# Altium schematic sheet FPGA_PWR_CONFIG.SchDoc: SPEC-A7
size 420 x 297 mm; Author: G.Kasprowicz; CompanyName: WUT ISE; DrawnBy: G.Kasprowicz; Organization: WUT ISE; Address1: PW ISE; Address2: Nowowiejska 15/19 00-665 Warsaw; Address3: gkasprow@gmail.com; Revision: 2; SheetNumber: 6; SheetTotal: 18; ModifiedBy: -; CheckedDate: -; Title2: FPGA Power & Config; DivGrp: WUT ISE; Designer: G.Kasprowicz; ModifiedDate: -; ProjectName: Sensor Box
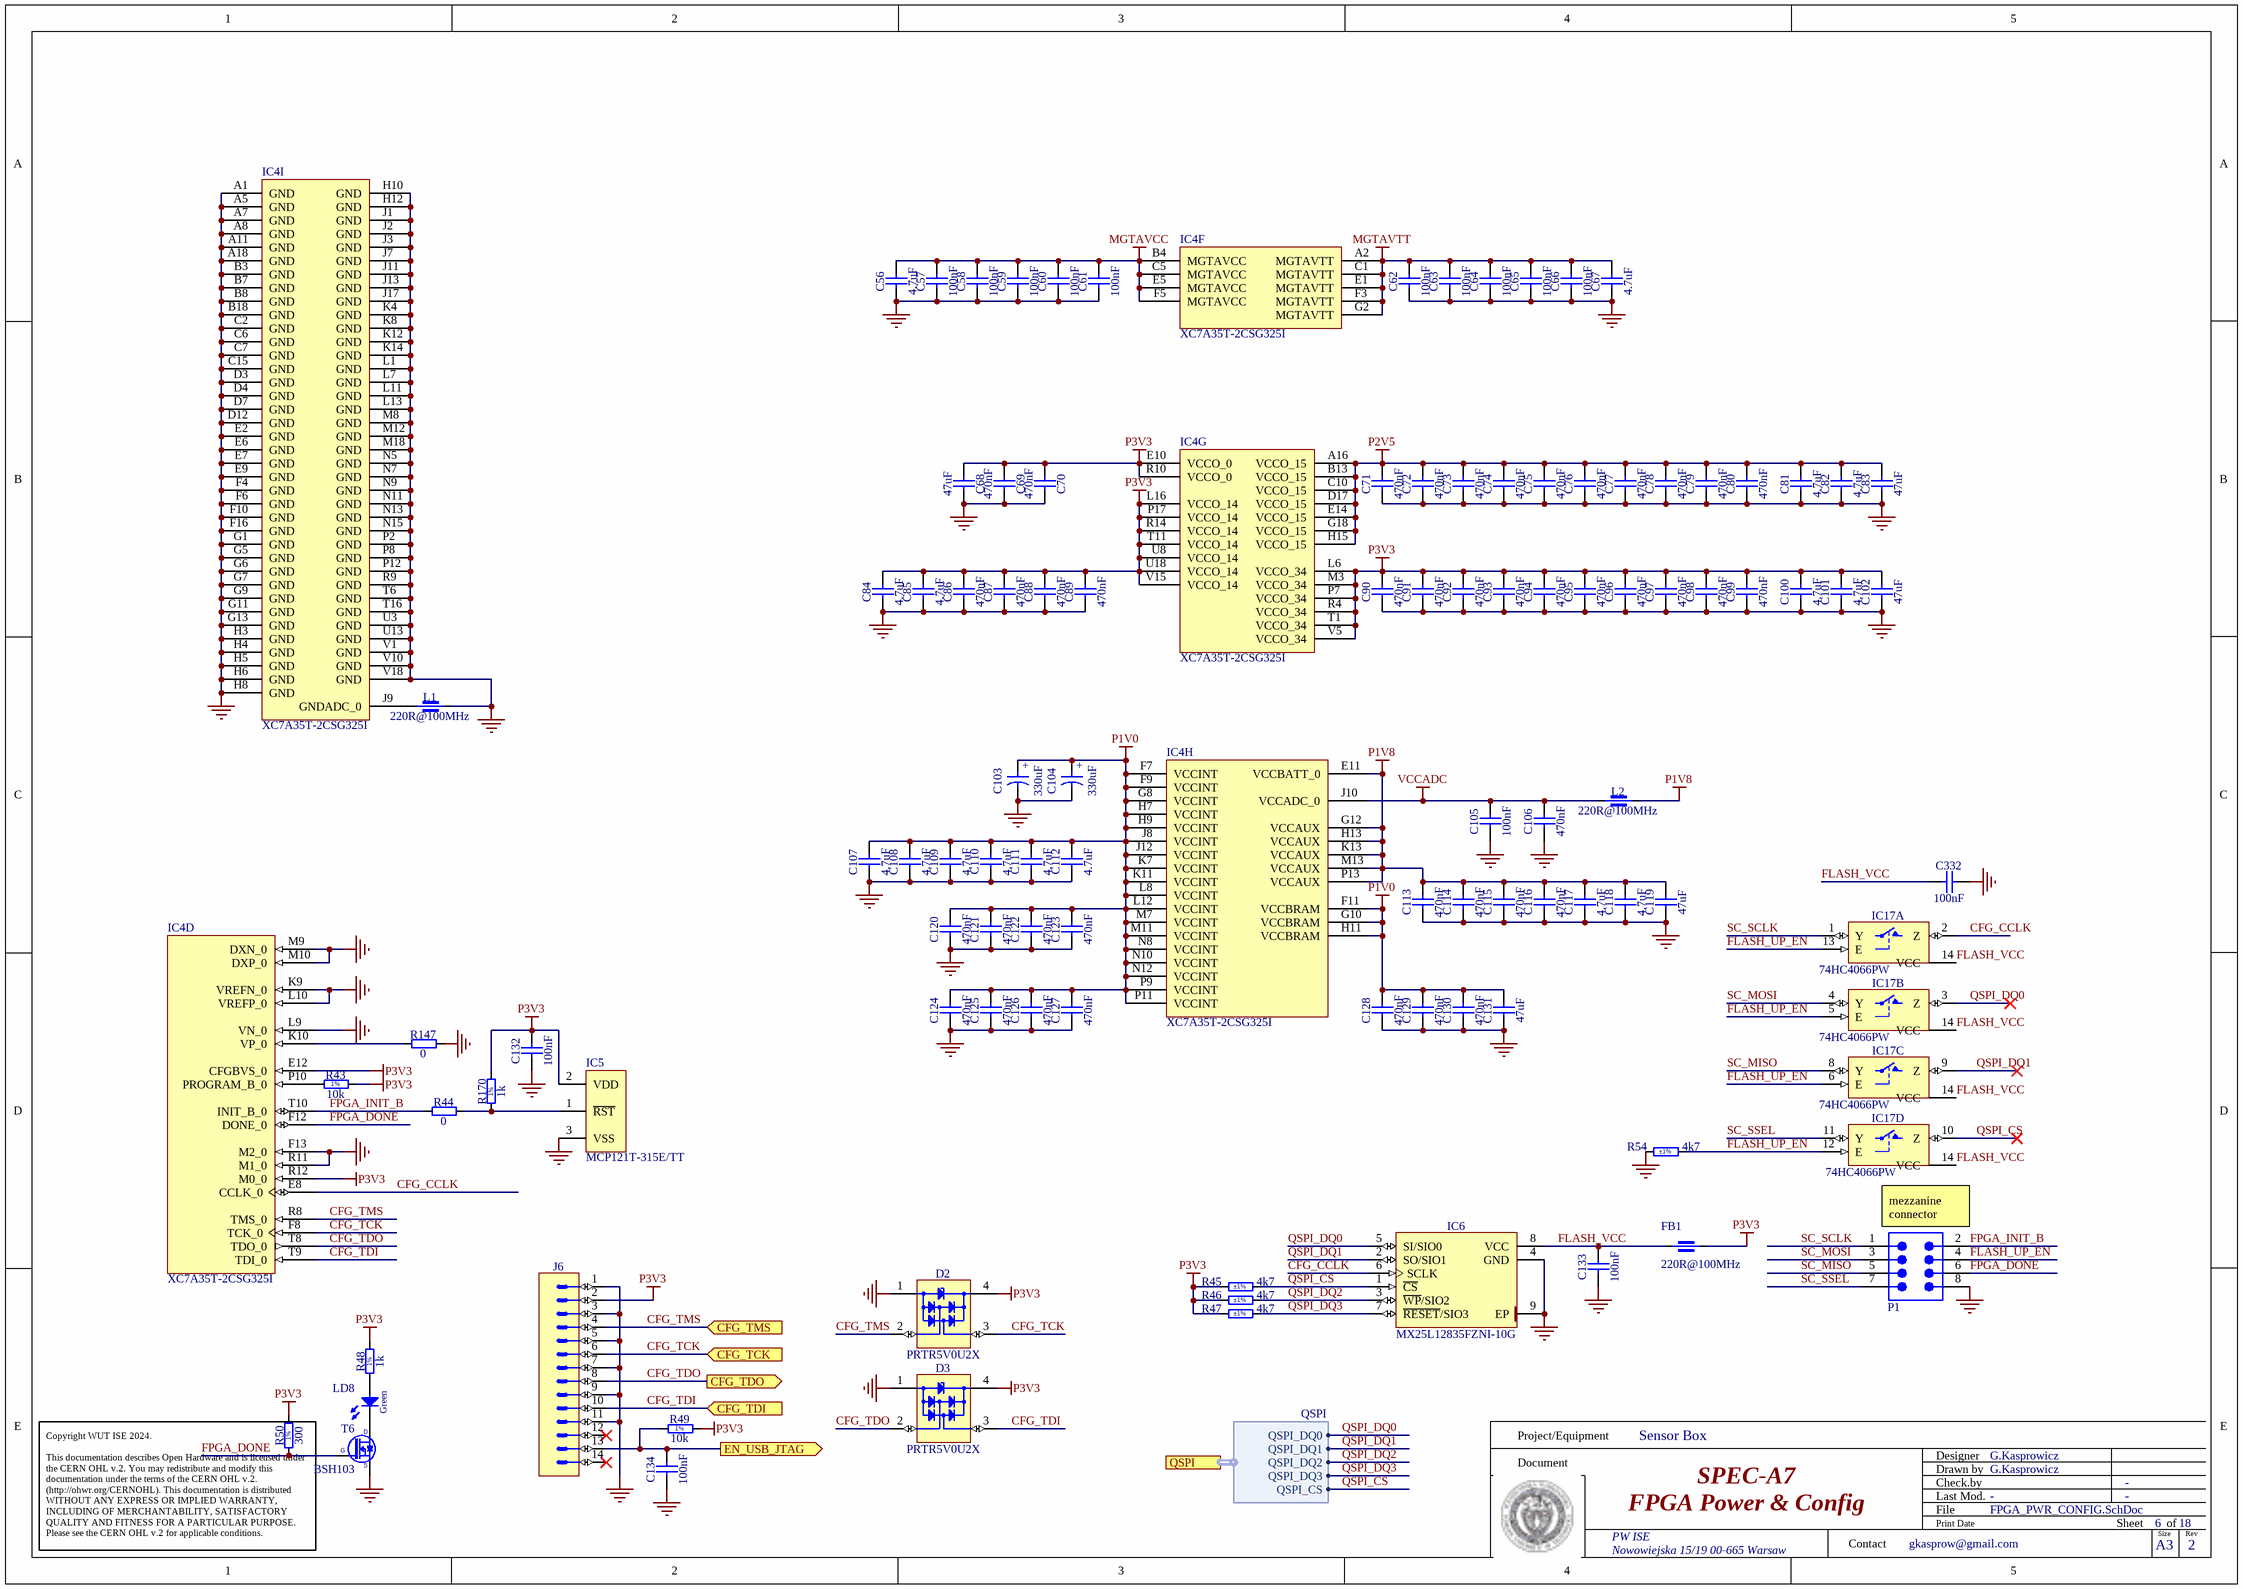
[diagram p0: FPGA_PWR_CONFIG.SchDoc]

## Parts
C56  4.7uF  [CAPC1005X55N]
C57  100nF  [CAPC0603X33N]
C58  100nF  [CAPC0603X33N]
C59  100nF  [CAPC0603X33N]
C60  100nF  [CAPC0603X33N]
C61  100nF  [CAPC0603X33N]
C62  100nF  [CAPC0603X33N]
C63  100nF  [CAPC0603X33N]
C64  100nF  [CAPC0603X33N]
C65  100nF  [CAPC0603X33N]
C66  100nF  [CAPC0603X33N]
C67  4.7uF  [CAPC1005X55N]
C68  47uF  [CAPC1608X100N]
C69  470nF  [CAPC0603X33N]
C70  470nF  [CAPC0603X33N]
C71  470nF  [CAPC0603X33N]
C72  470nF  [CAPC0603X33N]
C73  470nF  [CAPC0603X33N]
C74  470nF  [CAPC0603X33N]
C75  470nF  [CAPC0603X33N]
C76  470nF  [CAPC0603X33N]
C77  470nF  [CAPC0603X33N]
C78  470nF  [CAPC0603X33N]
C79  470nF  [CAPC0603X33N]
C80  470nF  [CAPC0603X33N]
C81  4.7uF  [CAPC1005X55N]
C82  4.7uF  [CAPC1005X55N]
C83  47uF  [CAPC1608X100N]
C84  4.7uF  [CAPC1005X55N]
C85  4.7uF  [CAPC1005X55N]
C86  470nF  [CAPC0603X33N]
C87  470nF  [CAPC0603X33N]
C88  470nF  [CAPC0603X33N]
C89  470nF  [CAPC0603X33N]
C90  470nF  [CAPC0603X33N]
C91  470nF  [CAPC0603X33N]
C92  470nF  [CAPC0603X33N]
C93  470nF  [CAPC0603X33N]
C94  470nF  [CAPC0603X33N]
C95  470nF  [CAPC0603X33N]
C96  470nF  [CAPC0603X33N]
C97  470nF  [CAPC0603X33N]
C98  470nF  [CAPC0603X33N]
C99  470nF  [CAPC0603X33N]
C100  4.7uF  [CAPC1005X55N]
C101  4.7uF  [CAPC1005X55N]
C102  47uF  [CAPC1608X100N]
C103  330uF  [CAPMP7343X190N]
C104  330uF  [CAPMP7343X190N]
C105  100nF  [CAPC0603X33N]
C106  470nF  [CAPC0603X33N]
C107  4.7uF  [CAPC1005X55N]
C108  4.7uF  [CAPC1005X55N]
C109  4.7uF  [CAPC1005X55N]
C110  4.7uF  [CAPC1005X55N]
C111  4.7uF  [CAPC1005X55N]
C112  4.7uF  [CAPC1005X55N]
C113  470nF  [CAPC0603X33N]
C114  470nF  [CAPC0603X33N]
C115  470nF  [CAPC0603X33N]
C116  470nF  [CAPC0603X33N]
C117  4.7uF  [CAPC1005X55N]
C118  4.7uF  [CAPC1005X55N]
C119  47uF  [CAPC1608X100N]
C120  470nF  [CAPC0603X33N]
C121  470nF  [CAPC0603X33N]
C122  470nF  [CAPC0603X33N]
C123  470nF  [CAPC0603X33N]
C124  470nF  [CAPC0603X33N]
C125  470nF  [CAPC0603X33N]
C126  470nF  [CAPC0603X33N]
C127  470nF  [CAPC0603X33N]
C128  470nF  [CAPC0603X33N]
C129  470nF  [CAPC0603X33N]
C130  470nF  [CAPC0603X33N]
C131  47uF  [CAPC1608X100N]
C132  100nF  [CAPC0603X33N]
C133  100nF  [CAPC0603X33N]
C134  100nF  [CAPC0603X33N]
C332  100nF  [CAPC0603X33N]
D2  PRTR5V0U2X  [SOT190P230X110-4N]
D3  PRTR5V0U2X  [SOT190P230X110-4N]
FB1  220R@100MHz  [INDC1608X95N]
IC4  XC7A35T-2CSG325I  [CSG325]  (parts D,F,G,H,I of 9)
IC5  MCP121T-315E/TT  [SOT-23-TT3_L]
IC6  MX25L12835FZNI-10G  [SON127P600X500X80-9N-R350X410]
IC17  74HC4066PW  [SOP65P640X110-14N]  (parts A,B,C,D of 4)
J6  Milli-Grid™  [MOLEX_87832-1420]  (value not drawn)
L1  220R@100MHz  [INDC1005X55N]
L2  220R@100MHz  [INDC1005X55N]
LD8  Green  [LED_KINGBRIGHT_KPH-1608CGCK]
P1  61300821121  [61300821121]  (value not drawn)
R43  10k  [RESC1005X40N]
R44  0  [RESC1005X40N]
R45  4k7  Tolerance: ±1%  [RESC1005X40N]
R46  4k7  Tolerance: ±1%  [RESC1005X40N]
R47  4k7  Tolerance: ±1%  [RESC1005X40N]
R48  1k  [RESC1005X40N]
R49  10k  [RESC1005X40N]
R50  300  [RESC1005X40N]
R54  4k7  Tolerance: ±1%  [RESC1005X40N]
R147  0  [RESC1005X40N]
R170  1k  [RESC1005X40N]
T6  BSH103  [SOT95P230X110-3N]

## Ports
CFG_TCK (in, see SPEC-A7-TOP[3D]), CFG_TDI (in, see SPEC-A7-TOP[3D]), CFG_TDO (out, see SPEC-A7-TOP[3D]), CFG_TMS (in, see SPEC-A7-TOP[3D]), EN_USB_JTAG (out, see SPEC-A7-TOP[3D], USB_Serial_Quad[5C]), QSPI (harness QSPI, see SPEC-A7-TOP[3D], FPGA_14_15[3D])

## Harnesses
QSPI: QSPI_DQ0, QSPI_DQ1, QSPI_DQ2, QSPI_DQ3, QSPI_CS

## Nets
GND: C56.1 C57.1 C58.1 C59.1 C60.1 C61.1 C62.1 C63.1 C64.1 C65.1 C66.1 C67.1 C68.1 C69.1 C70.1 C71.1 C72.1 C73.1 C74.1 C75.1 C76.1 C77.1 C78.1 C79.1 C80.1 C81.1 C82.1 C83.1 C84.1 C85.1 C86.1 C87.1 C88.1 C89.1 C90.1 C91.1 C92.1 C93.1 C94.1 C95.1 C96.1 C97.1 C98.1 C99.1 C100.1 C101.1 C102.1 C103.2 C104.2 C105.1 C106.1 C107.1 C108.1 C109.1 C110.1 C111.1 C112.1 C113.1 C114.1 C115.1 C116.1 C117.1 C118.1 C119.1 C120.1 C121.1 C122.1 C123.1 C124.1 C125.1 C126.1 C127.1 C128.1 C129.1 C130.1 C131.1 C132.1 C133.1 C134.1 C332.2 D2.1(GND) D3.1(GND) IC4.A1(GND) IC4.A5(GND) IC4.A7(GND) IC4.A8(GND) IC4.A11(GND) IC4.A18(GND) IC4.B3(GND) IC4.B7(GND) IC4.B8(GND) IC4.B18(GND) IC4.C2(GND) IC4.C6(GND) IC4.C7(GND) IC4.C15(GND) IC4.D3(GND) IC4.D4(GND) IC4.D7(GND) IC4.D12(GND) IC4.E2(GND) IC4.E6(GND) IC4.E7(GND) IC4.E9(GND) IC4.F4(GND) IC4.F6(GND) IC4.F10(GND) IC4.F13(M2_0) IC4.F16(GND) IC4.G1(GND) IC4.G5(GND) IC4.G6(GND) IC4.G7(GND) IC4.G9(GND) IC4.G11(GND) IC4.G13(GND) IC4.H3(GND) IC4.H4(GND) IC4.H5(GND) IC4.H6(GND) IC4.H8(GND) IC4.H10(GND) IC4.H12(GND) IC4.J1(GND) IC4.J2(GND) IC4.J3(GND) IC4.J7(GND) IC4.J11(GND) IC4.J13(GND) IC4.J17(GND) IC4.K4(GND) IC4.K8(GND) IC4.K9(VREFN_0) IC4.K12(GND) IC4.K14(GND) IC4.L1(GND) IC4.L7(GND) IC4.L9(VN_0) IC4.L10(VREFP_0) IC4.L11(GND) IC4.L13(GND) IC4.M8(GND) IC4.M9(DXN_0) IC4.M10(DXP_0) IC4.M12(GND) IC4.M18(GND) IC4.N5(GND) IC4.N7(GND) IC4.N9(GND) IC4.N11(GND) IC4.N13(GND) IC4.N15(GND) IC4.P2(GND) IC4.P8(GND) IC4.P12(GND) IC4.R9(GND) IC4.R11(M1_0) IC4.T6(GND) IC4.T16(GND) IC4.U3(GND) IC4.U13(GND) IC4.V1(GND) IC4.V10(GND) IC4.V18(GND) IC5.3(VSS) IC6.4(GND) IC6.9(EP) IC17.7(GND) J6.1 J6.3 J6.5 J6.7 J6.9 J6.11 L1.2 P1.8 R54.1 R147.2 T6.2(S)
MGTAVCC: C56.2 C57.2 C58.2 C59.2 C60.2 C61.2 IC4.B4(MGTAVCC) IC4.C5(MGTAVCC) IC4.E5(MGTAVCC) IC4.F5(MGTAVCC)
MGTAVTT: C62.2 C63.2 C64.2 C65.2 C66.2 C67.2 IC4.A2(MGTAVTT) IC4.C1(MGTAVTT) IC4.E1(MGTAVTT) IC4.F3(MGTAVTT) IC4.G2(MGTAVTT)
P1V0: C103.1 C104.1 C107.2 C108.2 C109.2 C110.2 C111.2 C112.2 C120.2 C121.2 C122.2 C123.2 C124.2 C125.2 C126.2 C127.2 C128.2 C129.2 C130.2 C131.2 IC4.F7(VCCINT) IC4.F9(VCCINT) IC4.F11(VCCBRAM) IC4.G8(VCCINT) IC4.G10(VCCBRAM) IC4.H7(VCCINT) IC4.H9(VCCINT) IC4.H11(VCCBRAM) IC4.J8(VCCINT) IC4.J12(VCCINT) IC4.K7(VCCINT) IC4.K11(VCCINT) IC4.L8(VCCINT) IC4.L12(VCCINT) IC4.M7(VCCINT) IC4.M11(VCCINT) IC4.N8(VCCINT) IC4.N10(VCCINT) IC4.N12(VCCINT) IC4.P9(VCCINT) IC4.P11(VCCINT)
P1V8: C113.2 C114.2 C115.2 C116.2 C117.2 C118.2 C119.2 IC4.E11(VCCBATT_0) IC4.G12(VCCAUX) IC4.H13(VCCAUX) IC4.K13(VCCAUX) IC4.M13(VCCAUX) IC4.P13(VCCAUX) L2.2
P2V5: C71.2 C72.2 C73.2 C74.2 C75.2 C76.2 C77.2 C78.2 C79.2 C80.2 C81.2 C82.2 C83.2 IC4.A16(VCCO_15) IC4.B13(VCCO_15) IC4.C10(VCCO_15) IC4.D17(VCCO_15) IC4.E14(VCCO_15) IC4.G18(VCCO_15) IC4.H15(VCCO_15)
P3V3: C68.2 C69.2 C70.2 C84.2 C85.2 C86.2 C87.2 C88.2 C89.2 C90.2 C91.2 C92.2 C93.2 C94.2 C95.2 C96.2 C97.2 C98.2 C99.2 C100.2 C101.2 C102.2 C132.2 D2.4(VCC) D3.4(VCC) FB1.1 IC4.E10(VCCO_0) IC4.E12(CFGBVS_0) IC4.L6(VCCO_34) IC4.L16(VCCO_14) IC4.M3(VCCO_34) IC4.P7(VCCO_34) IC4.P17(VCCO_14) IC4.R4(VCCO_34) IC4.R10(VCCO_0) IC4.R12(M0_0) IC4.R14(VCCO_14) IC4.T1(VCCO_34) IC4.T11(VCCO_14) IC4.U8(VCCO_14) IC4.U18(VCCO_14) IC4.V5(VCCO_34) IC4.V15(VCCO_14) IC5.2(VDD) J6.2 R43.2 R45.1 R46.1 R47.1 R48.2 R49.2 R50.2 R170.2
VCCADC: C105.2 C106.2 IC4.J10(VCCADC_0) L2.1
CFG_CCLK: IC4.E8(CCLK_0) IC6.6(SCLK) IC17.2(Z)
CFG_TCK: D2.3(I/O2) IC4.F8(TCK_0) J6.6 ; port CFG_TCK
CFG_TDI: D3.3(I/O2) IC4.T9(TDI_0) J6.10 ; port CFG_TDI
CFG_TDO: D3.2(I/O1) IC4.T8(TDO_0) J6.8 ; port CFG_TDO
CFG_TMS: D2.2(I/O1) IC4.R8(TMS_0) J6.4 ; port CFG_TMS
EN_USB_JTAG: C134.2 J6.13 R49.1 ; port EN_USB_JTAG
FLASH_UP_EN: IC17.5(E) IC17.6(E) IC17.12(E) IC17.13(E) P1.4 R54.2
FLASH_VCC: C133.2 C332.1 FB1.2 IC6.8(VCC) IC17.14(VCC)
FPGA_DONE: IC4.F12(DONE_0) P1.6 R50.1 T6.1(G)
FPGA_INIT_B: IC4.T10(INIT_B_0) P1.2 R44.1
QSPI_CS: IC6.1(~{CS}) IC17.10(Z) R45.2 ; port QSPI.QSPI_CS
QSPI_DQ0: IC6.5(SI/SIO0) IC17.3(Z) ; port QSPI.QSPI_DQ0
QSPI_DQ1: IC6.2(SO/SIO1) IC17.9(Z) ; port QSPI.QSPI_DQ1
QSPI_DQ2: IC6.3(~{WP}/SIO2) R46.2 ; port QSPI.QSPI_DQ2
QSPI_DQ3: IC6.7(~{RESET}/SIO3) R47.2 ; port QSPI.QSPI_DQ3
SC_MISO: IC17.8(Y) P1.5
SC_MOSI: IC17.4(Y) P1.3
SC_SCLK: IC17.1(Y) P1.1
SC_SSEL: IC17.11(Y) P1.7
NetIC4_J9: IC4.J9(GNDADC_0) L1.1
NetIC4_K10: IC4.K10(VP_0) R147.1
NetIC4_P10: IC4.P10(PROGRAM_B_0) R43.1
NetIC5_1: IC5.1(~{RST}) R44.2 R170.1
NetLD8_1: LD8.1(C) T6.3(D)
NetLD8_2: LD8.2(A) R48.1

Not connected (* = marked no-connect by the designer): J6 12* 14*

## Notes on the sheet
- mezzanine connector
- Project/Equipment
- Document
- Designer
- Drawn by
- Check.by
- Copyright WUT ISE 2024.
  This documentation describes Open Hardware and is licensed under the CERN OHL v.2. You may redistribute and modify this documentation under the terms of the CERN OHL v.2. (http://ohwr.org/CERNOHL). This documentation is distributed WITHOUT ANY EXPRESS OR IMPLIED WARRANTY, INCLUDING OF MERCHANTABILITY, SATISFACTORY QUALITY AND FITNESS FOR A PARTICULAR PURPOSE. Please see the CERN OHL v.2 for applicable conditions.
- Contact
- File
- Last Mod.
- Print Date
- Sheet
- Size
- A3
- of
- Rev
- (in symbol CTE7343-19_330UF_2.5V_20%_LESR0025_KEMET_T520) +
- (in symbol R0402_1k_1%_0.0625W_100PPM) 1%
- (in symbol R0402_10K_1%_0.0625W_100PPM) 1%
- (in symbol R0402_300R_1%_0.0625W_100PPM) 1%

## Library data of the parts
C56 C67 C81 C82 C84 C85 C100 C101 C107-C112 C117 C118 = CC0402_4.7UF_6.3V_20%_X5R: Non-polarised capacitor; Part Description: SMD Multilayer Chip Ceramic Capacitor; Manufacturer: GENERIC; Manufacturer1 Part Number: C1005X5R0J475M050BC; Voltage: 6.3V; TC: X5R; Tolerance: ±20%; Part Number: CC0402_4.7UF_6.3V_20%_X5R; Component Kind: Standard; Component Type: Standard; Pin Count: 2; Value: 4.7uF; Status: Preferred; Manufacturer Part Number: CC0402_4.7UF_6.3V_20%_X5R; Case: 0402; Mounted: Yes; Socket: No; SMD: Yes; Sense: No; Manufacturer1 Example: TDK; Manufacturer1 ComponentHeight: 0.65mm; HelpURL: \\cern.ch\dfs\Applications\Altium\Datasheets\CC0402_X5R_TDK_C.pdf; Author: CERN DEM JLC; CreateDate: 03.03.2015; LatestRevisionDate: 03.03.2015
C57-C66 C105 C132-C134 C332 = CC0201_100NF_6.3V_10%_X5R: Non-polarised capacitor; Part Description: SMD Multilayer Chip Ceramic Capacitor; Manufacturer: GENERIC; Manufacturer1 Part Number: 02016D104KAT2A; Voltage: 6.3V; TC: X5R; Tolerance: ±10%; Part Number: CC0201_100NF_6.3V_10%_X5R; Component Kind: Standard; Component Type: Standard; Pin Count: 2; Value: 100nF; Status: Not Recommended; Manufacturer Part Number: CC0201_100NF_6.3V_10%_X5R; Case: 0201; Mounted: Yes; Socket: No; SMD: Yes; Sense: No; Manufacturer1 Example: AVX; Manufacturer1 ComponentHeight: 0.33mm; HelpURL: \\cern.ch\dfs\Applications\Altium\Datasheets\CC0201_X5R_AVX.pdf; Author: CERN DEM JLC
  C57-C66 C105 C332: CreateDate: 03.12.2007; LatestRevisionDate: 03.12.2007
  C132-C134: CreateDate: 2007-12-03; LatestRevisionDate: 2007-12-03; ClassName: FPGA_JTAG
C68 C83 C102 C119 C131 = CC0603_47UF_6.3V_20%_X5R: Non-polarised capacitor; Part Description: SMD Multilayer Chip Ceramic Capacitor; Manufacturer: GENERIC; Manufacturer1 Part Number: GRM188R60J476ME15D; Voltage: 6.3V; TC: X5R; Tolerance: ±20%; Part Number: CC0603_47UF_6.3V_20%_X5R; Component Kind: Standard; Component Type: Standard; Pin Count: 2; Value: 47uF; Status: None; Manufacturer Part Number: CC0603_47UF_6.3V_20%_X5R; Case: 0603; Mounted: Yes; Socket: No; SMD: Yes; Sense: No; Manufacturer1 Example: MURATA; Manufacturer1 ComponentHeight: 1mm; HelpURL: \\cern.ch\dfs\Applications\Altium\Datasheets\CC0603_MURATA_GRM188R60J476ME15D.pdf; Author: CERN DEM JLC; CreateDate: 01.02.2018; LatestRevisionDate: 01.02.2018
C69-C80 C86-C99 C106 C113-C116 C120-C130 = CC0201_470NF_4V_20%_X5R: Non-polarised capacitor; Part Description: SMD Multilayer Chip Ceramic Capacitor; Manufacturer: GENERIC; Manufacturer1 Part Number: AMK063BJ474MP-F; Voltage: 4V; TC: X5R; Tolerance: ±20%; Part Number: CC0201_470NF_4V_20%_X5R; Component Kind: Standard; Component Type: Standard; Pin Count: 2; Value: 470nF; Status: Not Recommended; Manufacturer Part Number: CC0201_470NF_4V_20%_X5R; Case: 0201; Mounted: Yes; Socket: No; SMD: Yes; Sense: No; Manufacturer1 Example: TAIYO YUDEN; Manufacturer1 ComponentHeight: 0.33mm; HelpURL: \\cern.ch\dfs\Applications\Altium\Datasheets\CC0201_X5R_TAIYO-YUDEN_STANDARD-CLASS2.pdf; Author: CERN DEM JLC; CreateDate: 27.05.2010; LatestRevisionDate: 27.05.2010
C103 C104 = CTE7343-19_330UF_2.5V_20%_LESR0025_KEMET_T520: Polarised capacitor; Part Description: Low ESR 0R025 Tantalum Chip Capacitor; Manufacturer: KEMET; Manufacturer Part Number: T520V337M2R5ATE025; Voltage: 2.5V; Tolerance: ±20%; Part Number: CTE7343-19_330UF_2.5V_20%_LESR0025_KEMET_T520; Component Kind: Standard; Component Type: Standard; Pin Count: 2; Value: 330uF; Status: None; Case: V; Mounted: Yes; Socket: No; SMD: Yes; Sense: No; ComponentHeight: 1.9mm; HelpURL: \\cern.ch\dfs\Applications\Altium\Datasheets\CTE-LESR_KEMET_T520.pdf; Author: CERN DEM MR; CreateDate: 23.03.2016; LatestRevisionDate: 23.03.2016
D2 D3 = PRTR5V0U2X: Ultra Low Capacitance Double Rail-to-Rail ESD Protection Diode; Part Description: Ultra Low Capacitance (1pF) Double Rail-to-Rail ESD Protection Diode (8kV); Manufacturer: NXP SEMICONDUCTORS; Voltage: 5.5V; PressFit: No; Bonding: No; Part Number: PRTR5V0U2X; Component Kind: Standard; Component Type: Standard; Device: PRTR5V0U2X; PackageDescription: SOT143B, SOT, 1.90mm Pitch; 4 Pin, 1.30mm W X 2.90mm L X 1.10mm H body, IPC Medium Density; Manufacturer Part Number: PRTR5V0U2X; Pin Count: 4; Case: SOT143B; Mounted: Yes; Socket: No; SMD: Yes; Sense: No; ComponentHeight: 1.1mm; HelpURL: \\cern.ch\dfs\Applications\Altium\Datasheets\PRTR5V0U2X.pdf; Author: CERN DEM JLC; CreateDate: 22.03.2011; LatestRevisionDate: 22.03.2011
FB1 = IND0603_MURATA_BLM18SG221TN1: Part Description: SMD EMIFIL Suppression Chip Ferrite Bead; Manufacturer: MURATA; Tolerance: ±25%; Power: 2.5A; Resistance: 0.04R; Part Number: IND0603_MURATA_BLM18SG221TN1; Component Kind: Standard; Component Type: Standard; Pin Count: 2; Value: 220R@100MHz; Manufacturer Part Number: BLM18SG221TN1; Case: 0603; Mounted: Yes; Socket: No; SMD: Yes; Sense: No; ComponentHeight: 0.95mm; HelpURL: \\cern.ch\dfs\Applications\Altium\Datasheets\IND0603_MURATA_BLM18S.pdf; Author: CERN DEM MR; CreateDate: 08.01.2016; LatestRevisionDate: 25.10.2018
IC4 = CMP-0383-00003-1: Artix-7 FPGA, 150 User I/Os, 4 GTP, 324-Ball BGA, Speed Grade 2, Industrial Grade, Pb-Free; Manufacturer: Xilinx; Available User I/O: 150; Speed Grades: 2; GTP: 4; Logic Cells: 33280; Total Block RAM: 1800 Kb; CMTs: 5; ComponentLink3URL: http://www.xilinx.com/support/documentation/user_guides/ug475_7Series_Pkg_Pinout.pdf; Maximum Distributed RAM: 400 Kb; Operating Temperature Range: Industrial; ComponentLink1URL: http://www.xilinx.com/; Mounting Technology: Surface Mount; ComponentLink1Description: Manufacturer URL; ComponentLink2Description: Datasheet; PartNumber: XC7A35T-2CSG325I; PackageVersion: Rev. 1.11; PackageDescription: 324-Ball Wire-Bond Chip-Scale BGA, Body 15 x 15 mm, Pitch 0.8 mm; DatasheetVersion: Rev. 1.15; PackageReference: CSG-325; ComponentLink3Description: Pinout; ComponentLink4Description: Package Specification; ComponentLink2URL: http://www.xilinx.com/support/documentation/data_sheets/ds180_7Series_Overview.pdf; ComponentLink4URL: http://www.xilinx.com/support/documentation/user_guides/ug475_7Series_Pkg_Pinout.pdf
IC5 = CMP-0138-00412-1: Micropower Voltage Supervisors, 3-Pin SOT-23, Extended Temperature, Tape and Reel; PackageReference: SOT-23-TT3; PackageVersion: revBB, Aug-2009; DatasheetVersion: revB, Mar-2005; Code_IPC: SOT23-3; PackageDescription: 3-Lead Plastic Small Outline Transistor (TT) [SOT-23]
IC6 = MX25L12835FZNI-10G: 128Mb, 3V, Serial Multi I/O Flash Memory; Part Description: 128Mb (16M x 8), 3V, CMOS MXSMIO® Serial Multi I/O Flash Memory; Manufacturer: MACRONIX; PressFit: No; Bonding: No; Part Number: MX25L12835FZNI-10G; Component Kind: Standard; Component Type: Standard; Device: MX25L12835FZNI-10G; PackageDescription: SON, 1.27mm Pitch, 8 Pin, 6.00mm W X 5.00mm L X 0.80mm H body (w/Thermal Tab  3.50 X 4.10mm), IPC Medium Density; Manufacturer Part Number: MX25L12835FZNI-10G; Pin Count: 9; Case: SON8; Mounted: Yes; Socket: No; SMD: Yes; Sense: No; ComponentHeight: 2.16mm; HelpURL: \\cern.ch\dfs\Applications\Altium\Datasheets\MX25L12835.pdf; Author: CERN DEM HF; CreateDate: 16.04.2024; LatestRevisionDate: 16.04.2024
IC17 = 74HC4066PW: Part Description: Quad Single-Pole Single-Throw Analog Switch; Manufacturer: NXP SEMICONDUCTORS; PressFit: No; Bonding: No; Table: Standard Logic; Part Number: 74HC4066PW; Component Kind: Standard; Component Type: Standard; Device: 74HC4066PW; PackageDescription: SOP, 14-Leads, Body 4.4x5mm (max), Pitch 0.65mm, IPC Medium Density; Manufacturer Part Number: 74HC4066PW; Pin Count: 14; Case: TSSOP14; Mounted: Yes; Socket: No; SMD: Yes; ComponentHeight: 1.1mm; Author: CERN DEM JLC; HelpURL: \\cern.ch\dfs\Applications\Altium\Datasheets\74HC4066PW.pdf; CreateDate: 2014-11-19; LatestRevisionDate: 2014-11-19
J6 = MOLEX_87832-1420: Connector 14 Male; Part Description: 2.00mm (.079") Pitch Milli-Grid™ Header, Surface Mount, Vertical, Shrouded, 14 Circuits,with Locking Windows and Centre Polarization Slot, PCB Locator; Manufacturer: MOLEX; PressFit: No; Part Number: MOLEX_87832-1420; Component Kind: Standard; Component Type: Standard; Pin Count: 14; Family: Milli-Grid™; Mounted: Yes; Socket: No; SMD: Yes; Sense: No; Status: None; Manufacturer Part Number: 87832-1420; ComponentHeight: 7.6mm; HelpURL: \\cern.ch\dfs\Applications\Altium\Datasheets\MOLEX_87832-1420.pdf; Author: CERN DEM JLC; CreateDate: 09.09.2008; LatestRevisionDate: 09.09.2008
L1 L2 = IND0402_MURATA_BLM15HB221SN1: Part Description: SMD EMIFIL Suppression Chip Ferrite Bead; Manufacturer: MURATA; Power: 250mA; Resistance: 1R; Tolerance: ±25%; Part Number: IND0402_MURATA_BLM15HB221SN1; Component Kind: Standard; Component Type: Standard; Pin Count: 2; Value: 220R@100MHz; Status: None; Manufacturer Part Number: BLM15HB221SN1; Case: 0402; Mounted: Yes; Socket: No; SMD: Yes; Sense: No; ComponentHeight: 0.55mm; HelpURL: \\cern.ch\dfs\Applications\Altium\Datasheets\IND0402_MURATA_BLM15H.pdf; Author: CERN DEM JLC; CreateDate: 23.06.2009; LatestRevisionDate: 25.10.2018
LD8 = LED_KINGBRIGHT_KPH-1608CGCK: LED Green 1C 2A; Part Description: SMD Green LED, Case 1.6mmX0.8mm(0603), 0.65mm Thickness; PressFit: No; Bonding: No; Manufacturer Part Number: KPH-1608CGCK; ComponentHeight: 0.65mm; HelpURL: \\cern.ch\dfs\Applications\Altium\Datasheets\LED_KINGBRIGHT_KPH-1608CGCK.pdf; Part Number: LED_KINGBRIGHT_KPH-1608CGCK; Component Kind: Standard; Component Type: Standard; Color: Green; PackageDescription: SMT Green LED, Case 0603, Body L 1.6 x W 0.8mm H 0.65mm; Manufacturer: KINGBRIGHT; Pin Count: 2; Mounted: Yes; Socket: No; SMD: Yes; Sense: No; Author: CERN DEM JLC; CreateDate: 03.07.2017; LatestRevisionDate: 03.07.2017
P1 = 61300821121: WR-PHD Pin Header, THT, Vertical, pitch 2.54mm, 2 Row, 8P; Manufacturer: Wurth Elektronik; Contact Resistance: 20mOhm; Rated Current: 3A; Working Voltage: 250V; Withstanding Voltage: 500V; Manufacturer Part Number: 61300821121; Category: Board-to-Board Connectors; Match Code: WR-PHD; ComponentLink1Description: Website Link; ComponentLink1URL: https://www.we-online.com/redexpert/article/61300821121?ad; ComponentLink2Description: Datasheet Link; ComponentLink2URL: https://www.we-online.com/redexpert/spec/61300821121?ad; Mount: Through Hole; Operating Temperature Max: 105°C; Operating Temperature Min: -40°C; Packaging: Bag; Gender: Pin Header; Number of Pins: 8; Number of Rows: 2; Orientation: Vertical; Pitch: 2.54mm
R43 R49 = R0402_10K_1%_0.0625W_100PPM: Resistor - 1%; Part Description: General Purpose Thick Film Chip Resistor; Manufacturer: GENERIC; Manufacturer1 Part Number: 232270671003L; TC: ±100ppm/°C; PressFit: No; Part Number: R0402_10K_1%_0.0625W_100PPM; Component Kind: Standard; Component Type: Standard; Pin Count: 2; Value: 10k; Status: Not Recommended; Power: 0.0625W; Tolerance: ±1%; Manufacturer Part Number: R0402_10K_1%_0.0625W_100PPM; Case: 0402; Mounted: Yes; Sense: No; Socket: No; SMD: Yes; Manufacturer1 Example: YAGEO PHYCOMP; Manufacturer1 ComponentHeight: 0.4mm; HelpURL: \\cern.ch\dfs\Applications\Altium\Datasheets\R0402_Phycomp_RC0402.pdf; Author: CERN DEM JLC; CreateDate: 03.12.2007; LatestRevisionDate: 17.10.2012; ClassName: FPGA_JTAG
R44 R147 = R0402_0R_JUMPER: Resistor; Part Description: 1A (0.05R Max DC Resistance) Zero Ohm Jumper; Manufacturer: GENERIC; Manufacturer1 Part Number: 232270591001L; PressFit: No; Part Number: R0402_0R_JUMPER; Component Kind: Standard; Component Type: Standard; Pin Count: 2; Value: 0; Status: Not Recommended; Manufacturer Part Number: R0402_0R_JUMPER; Case: 0402; Mounted: Yes; Sense: No; Socket: No; SMD: Yes; Manufacturer1 Example: YAGEO PHYCOMP; Manufacturer1 ComponentHeight: 0.4mm; HelpURL: \\cern.ch\dfs\Applications\Altium\Datasheets\R0402_Phycomp_RC0402.pdf; Author: CERN DEM JLC; CreateDate: 03.12.2007; LatestRevisionDate: 17.10.2012; ClassName: Artix
R45-R47 R54 = R0402_4K7_1%_0.0625W_100PPM: Resistor - 1%; Part Description: General Purpose Thick Film Chip Resistor; Manufacturer: GENERIC; Manufacturer1 Part Number: 232270674702L; TC: ±100ppm/°C; PressFit: No; Part Number: R0402_4K7_1%_0.0625W_100PPM; Component Kind: Standard; Component Type: Standard; Pin Count: 2; Value: 4k7; Status: Not Recommended; Power: 0.0625W; Manufacturer Part Number: R0402_4K7_1%_0.0625W_100PPM; Case: 0402; Mounted: Yes; Sense: No; Socket: No; SMD: Yes; Manufacturer1 Example: YAGEO PHYCOMP; Manufacturer1 ComponentHeight: 0.4mm; HelpURL: \\cern.ch\dfs\Applications\Altium\Datasheets\R0402_Phycomp_RC0402.pdf; Author: CERN DEM JLC; CreateDate: 03.12.2007; LatestRevisionDate: 17.10.2012
R48 R170 = R0402_1k_1%_0.0625W_100PPM: Resistor - 1%; Part Description: General Purpose Thick Film Chip Resistor; Manufacturer: GENERIC; Manufacturer1 Part Number: 232270671002L; TC: ±100ppm/°C; PressFit: No; Part Number: R0402_1K_1%_0.0625W_100PPM; Component Kind: Standard; Component Type: Standard; Pin Count: 2; Value: 1k; Status: Not Recommended; Power: 0.0625W; Tolerance: ±1%; Manufacturer Part Number: R0402_1K_1%_0.0625W_100PPM; Case: 0402; Mounted: Yes; Sense: No; Socket: No; SMD: Yes; Manufacturer1 Example: YAGEO PHYCOMP; Manufacturer1 ComponentHeight: 0.4mm; HelpURL: \\cern.ch\dfs\Applications\Altium\Datasheets\R0402_Phycomp_RC0402.pdf; Author: CERN DEM JLC; CreateDate: 03.12.2007; LatestRevisionDate: 17.10.2012; ClassName: Artix
R50 = R0402_300R_1%_0.0625W_100PPM: Resistor - 1%; Part Description: General Purpose Thick Film Chip Resistor; Manufacturer: GENERIC; Manufacturer1 Part Number: 232270673001L; TC: ±100ppm/°C; PressFit: No; Part Number: R0402_300R_1%_0.0625W_100PPM; Component Kind: Standard; Component Type: Standard; Pin Count: 2; Value: 300; Status: Not Recommended; Power: 0.0625W; Tolerance: ±1%; Manufacturer Part Number: R0402_300R_1%_0.0625W_100PPM; Case: 0402; Mounted: Yes; Sense: No; Socket: No; SMD: Yes; Manufacturer1 Example: YAGEO PHYCOMP; Manufacturer1 ComponentHeight: 0.4mm; HelpURL: \\cern.ch\dfs\Applications\Altium\Datasheets\R0402_Phycomp_RC0402.pdf; Author: CERN DEM JLC; CreateDate: 03.12.2007; LatestRevisionDate: 17.10.2012
T6 = BSH103: N-CHANNEL MOSFET WITH DIODE; Part Description: 30V 850mA N-Channel Enhancement Mode Field-Effect Transistor; Manufacturer: NEXPERIA; PressFit: No; Bonding: No; Part Number: BSH103; Component Kind: Standard; Component Type: Standard; Device: BSH103; PackageDescription: SOT23, 3 pin, Pitch 0.95mm - 1.3mm W X 2.9mm L X 1.1mm H, IPC Medium Density; Manufacturer Part Number: BSH103; Pin Count: 3; Case: SOT23-3; Mounted: Yes; Socket: No; SMD: Yes; Sense: No; ComponentHeight: 1.1mm; HelpURL: \\cern.ch\dfs\Applications\Altium\Datasheets\BSH103.pdf; Author: CERN DEM JLC; CreateDate: 16.03.2010; LatestRevisionDate: 20.06.2017; ClassName: Artix